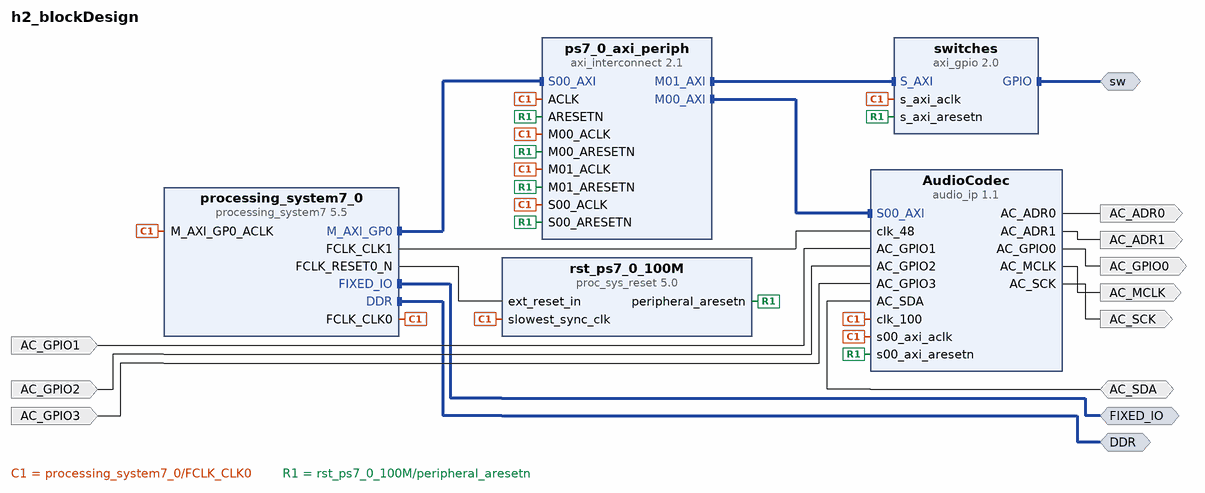
[diagram p0: block diagram of the top level]
# Vivado block design h2_blockDesign, xc7z020clg484-1, Vivado 2018.3
create_bd_design h2_blockDesign

create_bd_intf_port -mode Master -vlnv xilinx.com:interface:ddrx_rtl:1.0 DDR
create_bd_intf_port -mode Master -vlnv xilinx.com:display_processing_system7:fixedio_rtl:1.0 FIXED_IO
create_bd_intf_port -mode Master -vlnv xilinx.com:interface:gpio_rtl:1.0 sw
create_bd_port -dir O AC_ADR0
create_bd_port -dir O AC_ADR1
create_bd_port -dir O AC_GPIO0
create_bd_port -dir O AC_MCLK
create_bd_port -dir O AC_SCK
create_bd_port -dir IO AC_SDA
create_bd_port -dir I AC_GPIO1
create_bd_port -dir I AC_GPIO2
create_bd_port -dir I AC_GPIO3

create_bd_cell -type ip -vlnv xilinx.com:ip:processing_system7:5.5 processing_system7_0
set_property -dict [list \
  CONFIG.PCW_APU_PERIPHERAL_FREQMHZ 666.666667 \
  CONFIG.PCW_ENET0_ENET0_IO {MIO 16 .. 27} \
  CONFIG.PCW_ENET0_GRP_MDIO_ENABLE 1 \
  CONFIG.PCW_ENET0_GRP_MDIO_IO {MIO 52 .. 53} \
  CONFIG.PCW_ENET0_PERIPHERAL_ENABLE 1 \
  CONFIG.PCW_EN_CLK1_PORT 1 \
  CONFIG.PCW_FCLK0_PERIPHERAL_CLKSRC {ARM PLL} \
  CONFIG.PCW_FCLK1_PERIPHERAL_CLKSRC {ARM PLL} \
  CONFIG.PCW_FCLK_CLK1_BUF TRUE \
  CONFIG.PCW_FPGA0_PERIPHERAL_FREQMHZ 100.000000 \
  CONFIG.PCW_FPGA1_PERIPHERAL_FREQMHZ 48 \
  CONFIG.PCW_FPGA_FCLK1_ENABLE 1 \
  CONFIG.PCW_GPIO_MIO_GPIO_ENABLE 0 \
  CONFIG.PCW_PRESET_BANK1_VOLTAGE {LVCMOS 1.8V} \
  CONFIG.PCW_QSPI_GRP_SINGLE_SS_ENABLE 1 \
  CONFIG.PCW_QSPI_GRP_SINGLE_SS_IO {MIO 1 .. 6} \
  CONFIG.PCW_QSPI_PERIPHERAL_ENABLE 1 \
  CONFIG.PCW_QSPI_QSPI_IO {MIO 1 .. 6} \
  CONFIG.PCW_SD0_PERIPHERAL_ENABLE 0 \
  CONFIG.PCW_SDIO_PERIPHERAL_FREQMHZ 50 \
  CONFIG.PCW_SINGLE_QSPI_DATA_MODE x4 \
  CONFIG.PCW_TTC0_PERIPHERAL_ENABLE 1 \
  CONFIG.PCW_TTC0_TTC0_IO EMIO \
  CONFIG.PCW_UART1_PERIPHERAL_ENABLE 1 \
  CONFIG.PCW_UART1_UART1_IO {MIO 48 .. 49} \
  CONFIG.PCW_UART_PERIPHERAL_FREQMHZ 50 \
  CONFIG.PCW_UIPARAM_DDR_FREQ_MHZ 533.333313 \
  CONFIG.PCW_UIPARAM_DDR_PARTNO {MT41J128M16 HA-15E} \
  CONFIG.PCW_USB0_PERIPHERAL_ENABLE 0 \
  CONFIG.preset ZedBoard \
] [get_bd_cells processing_system7_0]
# 128 more settings of processing_system7_0 are not shown: defaults, MIO pin electricals, DDR timing, and values the tool derives
create_bd_cell -type ip -vlnv xilinx.com:ip:axi_gpio:2.0 switches
set_property -dict {CONFIG.GPIO_BOARD_INTERFACE sws_8bits CONFIG.USE_BOARD_FLOW true} [get_bd_cells switches]
create_bd_cell -type ip -vlnv xilinx.com:ip:axi_interconnect:2.1 ps7_0_axi_periph
set_property -dict {CONFIG.NUM_MI 2} [get_bd_cells ps7_0_axi_periph]
create_bd_cell -type ip -vlnv xilinx.com:ip:proc_sys_reset:5.0 rst_ps7_0_100M
create_bd_cell -type ip -vlnv ehu.es:user:audio_ip:1.1 AudioCodec

# ---- connections ----

connect_bd_intf_net [get_bd_intf_pins processing_system7_0/M_AXI_GP0] [get_bd_intf_pins ps7_0_axi_periph/S00_AXI]
connect_bd_intf_net [get_bd_intf_ports FIXED_IO] [get_bd_intf_pins processing_system7_0/FIXED_IO]
connect_bd_intf_net [get_bd_intf_pins ps7_0_axi_periph/M00_AXI] [get_bd_intf_pins AudioCodec/S00_AXI]
connect_bd_intf_net [get_bd_intf_ports DDR] [get_bd_intf_pins processing_system7_0/DDR]
connect_bd_intf_net -intf_net axi_gpio_0_GPIO [get_bd_intf_ports sw] [get_bd_intf_pins switches/GPIO]
connect_bd_intf_net [get_bd_intf_pins ps7_0_axi_periph/M01_AXI] [get_bd_intf_pins switches/S_AXI]
connect_bd_net [get_bd_pins processing_system7_0/FCLK_CLK0] \
  [get_bd_pins processing_system7_0/M_AXI_GP0_ACLK] [get_bd_pins ps7_0_axi_periph/S00_ACLK] \
  [get_bd_pins rst_ps7_0_100M/slowest_sync_clk] [get_bd_pins ps7_0_axi_periph/M00_ACLK] [get_bd_pins ps7_0_axi_periph/ACLK] \
  [get_bd_pins switches/s_axi_aclk] [get_bd_pins ps7_0_axi_periph/M01_ACLK] [get_bd_pins AudioCodec/clk_100] \
  [get_bd_pins AudioCodec/s00_axi_aclk]
connect_bd_net [get_bd_pins processing_system7_0/FCLK_RESET0_N] [get_bd_pins rst_ps7_0_100M/ext_reset_in]
connect_bd_net [get_bd_pins rst_ps7_0_100M/peripheral_aresetn] \
  [get_bd_pins ps7_0_axi_periph/S00_ARESETN] [get_bd_pins ps7_0_axi_periph/M00_ARESETN] \
  [get_bd_pins ps7_0_axi_periph/ARESETN] [get_bd_pins switches/s_axi_aresetn] [get_bd_pins ps7_0_axi_periph/M01_ARESETN] \
  [get_bd_pins AudioCodec/s00_axi_aresetn]
connect_bd_net -net audio_ip_0_AC_ADR0 [get_bd_pins AudioCodec/AC_ADR0] [get_bd_ports AC_ADR0]
connect_bd_net -net audio_ip_0_AC_ADR1 [get_bd_pins AudioCodec/AC_ADR1] [get_bd_ports AC_ADR1]
connect_bd_net -net audio_ip_0_AC_GPIO0 [get_bd_pins AudioCodec/AC_GPIO0] [get_bd_ports AC_GPIO0]
connect_bd_net -net audio_ip_0_AC_MCLK [get_bd_pins AudioCodec/AC_MCLK] [get_bd_ports AC_MCLK]
connect_bd_net -net audio_ip_0_AC_SCK [get_bd_pins AudioCodec/AC_SCK] [get_bd_ports AC_SCK]
connect_bd_net [get_bd_ports AC_SDA] [get_bd_pins AudioCodec/AC_SDA]
connect_bd_net -net AC_GPIO1_0_1 [get_bd_ports AC_GPIO1] [get_bd_pins AudioCodec/AC_GPIO1]
connect_bd_net -net AC_GPIO2_0_1 [get_bd_ports AC_GPIO2] [get_bd_pins AudioCodec/AC_GPIO2]
connect_bd_net -net AC_GPIO3_0_1 [get_bd_ports AC_GPIO3] [get_bd_pins AudioCodec/AC_GPIO3]
connect_bd_net [get_bd_pins processing_system7_0/FCLK_CLK1] [get_bd_pins AudioCodec/clk_48]

# ---- address map ----
assign_bd_address -offset 0x41200000 -range 64K -target_address_space [get_bd_addr_spaces processing_system7_0/Data] [get_bd_addr_segs switches/S_AXI/Reg]
assign_bd_address -offset 0x43C00000 -range 64K -target_address_space [get_bd_addr_spaces processing_system7_0/Data] [get_bd_addr_segs AudioCodec/S00_AXI/S00_AXI_reg]

validate_bd_design
save_bd_design
